# EAGLE design Controller (EAGLE 7.5.0)
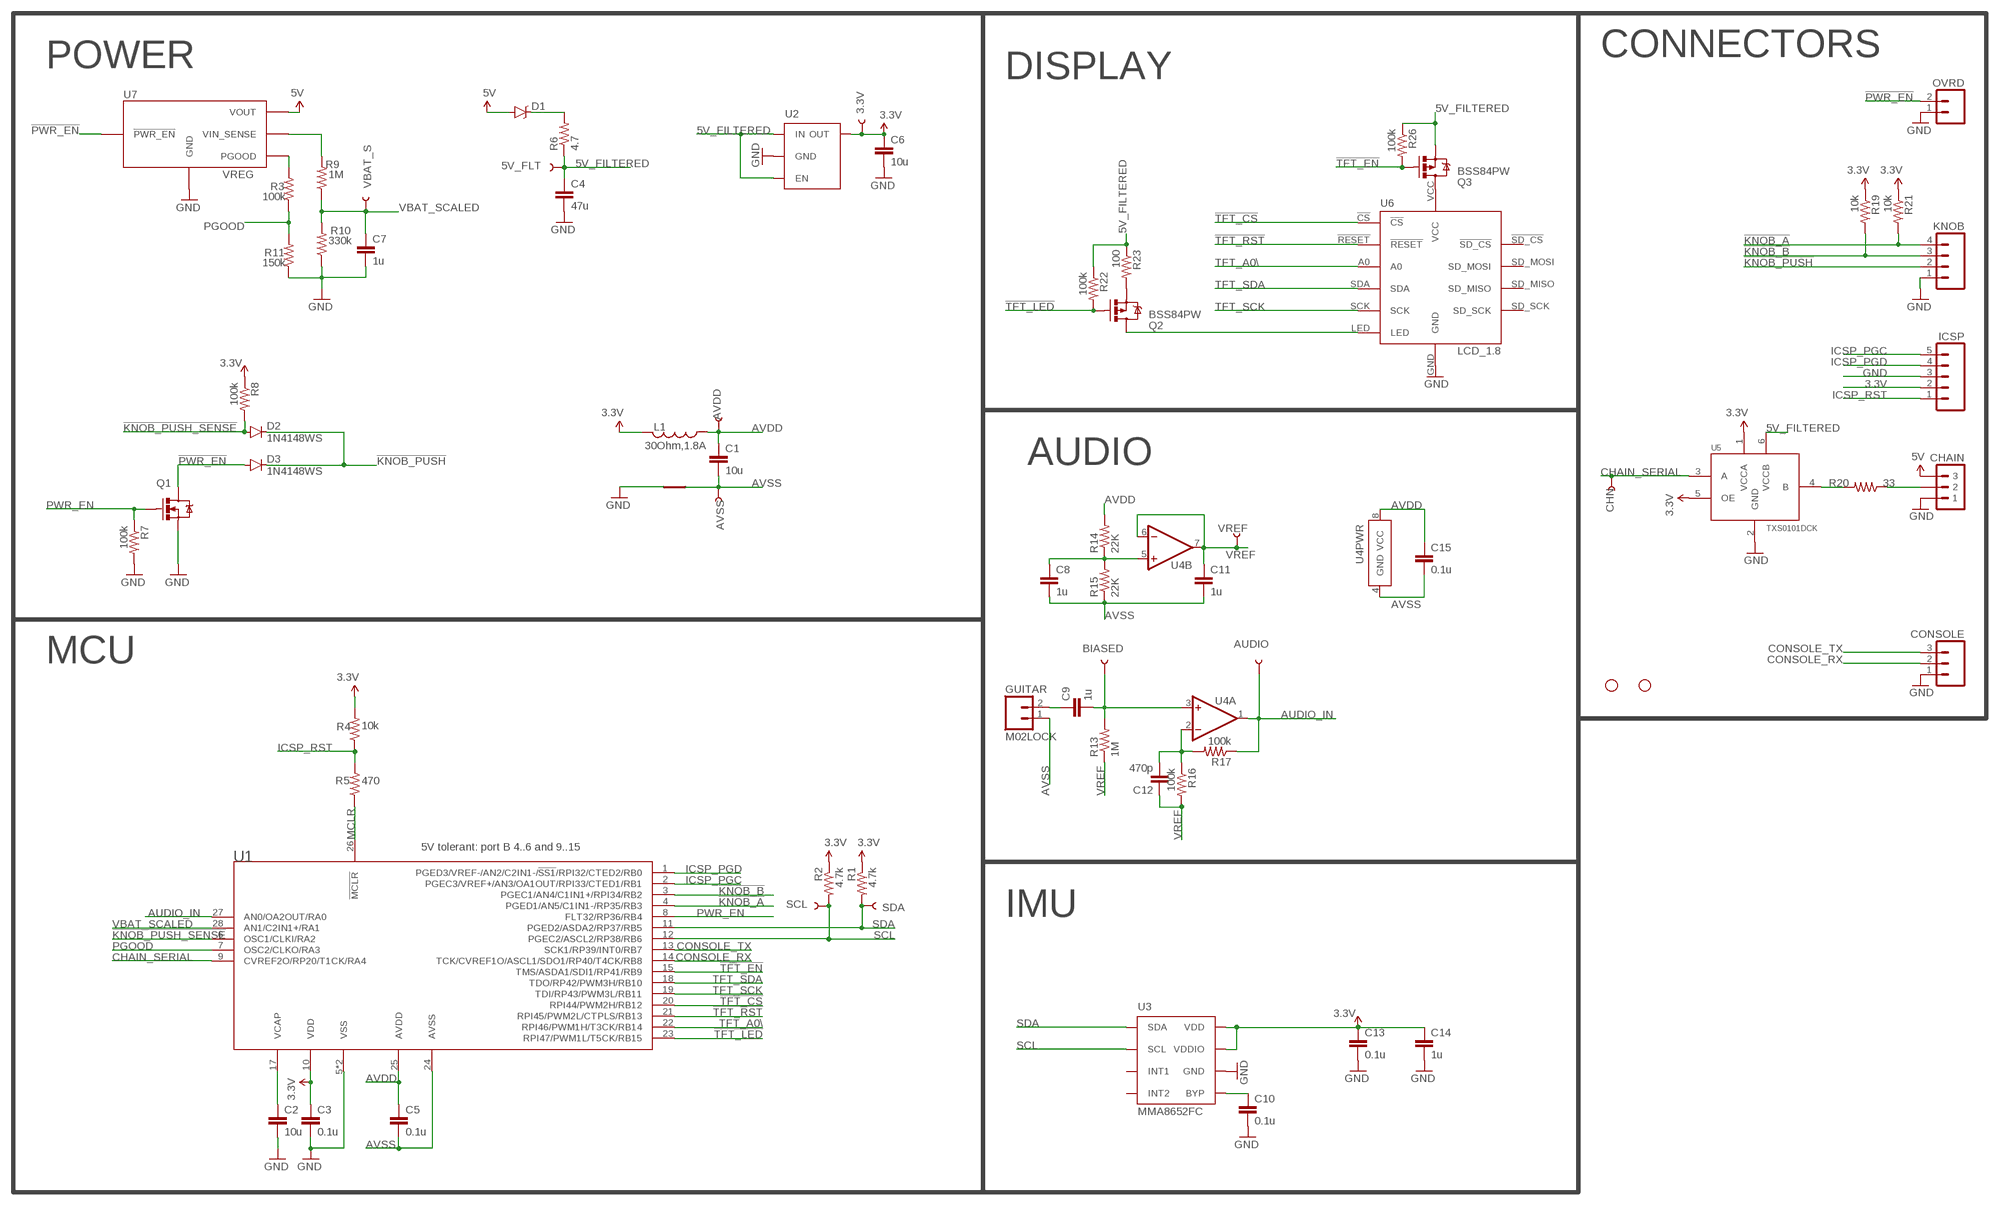
[diagram p0: schematic, sheet 1]

## Parts
3.3V  TEST-POINT3  [PAD.03X.03]
5V_FLT  TEST-POINT3  [PAD.03X.03]
AUDIO  TEST-POINT3  [PAD.03X.03]
AVDD  TEST-POINT3  [PAD.03X.03]
AVSS  TEST-POINT3  [PAD.03X.03]
BIASED  TEST-POINT3  [PAD.03X.03]
C1  10u  CAP0805  [0805]
C2  10u  CAP0805  [0805]
C3  0.1u  CAP0603-CAP  [0603-CAP]
C4  47u  CAP1206  [1206]
C5  0.1u  CAP0603-CAP  [0603-CAP]
C6  10u  10UF-6.3V-20%(0603)  [0603-CAP]
C7  1u  CAP0603-CAP  [0603-CAP]
C8  1u  CAP0603-CAP  [0603-CAP]
C9  1u  CAP0603-CAP  [0603-CAP]
C10  0.1u  CAP0603-CAP  [0603-CAP]
C11  1u  CAP0603-CAP  [0603-CAP]
C12  470p  CAP0603-CAP  [0603-CAP]
C13  0.1u  CAP0603-CAP  [0603-CAP]
C14  1u  CAP0603-CAP  [0603-CAP]
C15  0.1u  CAP0603-CAP  [0603-CAP]
CHAIN  M030.1PWR+SIG  [1X03-0.1PWR+SIG]
CHN  TEST-POINT3  [PAD.03X.03]
CONSOLE  M03LOCK  [1X03_LOCK]
D1  DB2J20900L  DIODE-SCHOTTKY-PMEG4005EJ  [SOD-323]
D2  1N4148WS  [SOD-323]
D3  1N4148WS  [SOD-323]
GUITAR  M02LOCK  [1X02_LOCK]
ICSP  M05LOCK  [1X05_LOCK]
JP1  STAND-OFF  [STAND-OFF]
JP2  STAND-OFF  [STAND-OFF]
KNOB  M04LOCK  [1X04_LOCK]
L1  30Ohm,1.8A  INDUCTOR0603  [0603]
OVRD  M02LOCK  [1X02_LOCK]
Q1  MOSFET-NCHANNEL2N7002PW  [SOT323]
Q2  BSS84PW  [SOT323]
Q3  BSS84PW  [SOT323]
R1  4.7k  RESISTOR0603  [0603-RES]
R2  4.7k  RESISTOR0603  [0603-RES]
R3  100k  RESISTOR0603  [0603-RES]
R4  10k  RESISTOR0603  [0603-RES]
R5  470  RESISTOR0603  [0603-RES]
R6  4.7  RESISTOR0603  [0603-RES]
R7  100k  RESISTOR0603  [0603-RES]
R8  100k  RESISTOR0603  [0603-RES]
R9  1M  RESISTOR0603  [0603-RES]
R10  330k  RESISTOR0603  [0603-RES]
R11  150k  RESISTOR0603  [0603-RES]
R13  1M  RESISTOR0603  [0603-RES]
R14  22K  RESISTOR0603  [0603-RES]
R15  22K  RESISTOR0603  [0603-RES]
R16  100k  RESISTOR0603  [0603-RES]
R17  100k  RESISTOR0603  [0603-RES]
R19  10k  RESISTOR0603  [0603-RES]
R20  33  RESISTOR0603  [0603-RES]
R21  10k  RESISTOR0603  [0603-RES]
R22  100k  RESISTOR0603  [0603-RES]
R23  100  RESISTOR0603  [0603-RES]
R26  100k  RESISTOR0603  [0603-RES]
SCL  TEST-POINT3  [PAD.03X.03]
SDA  TEST-POINT3  [PAD.03X.03]
SH1  SHORT  [SHORT_TOP-8]
U1  DSPIC33EPXXXMC202/502/PT  [QFN-S-28]
U2  MIC5365YC5  [SC70]
U3  MMA8652FC  [10-VFDFN]
U4  MCP6002MS  [MSOP-8]
U5  TXS0101DCK  [SC70-6]
U6  LCD_1.8  [LCD_1.8]
U7  VREG  [VREG]
VBAT_S  TEST-POINT3  [PAD.03X.03]
VREF  TEST-POINT3  [PAD.03X.03]

## Nets
3.3V: 3.3V.P$1 C3.1 C6.1 C13.1 C14.1 ICSP.2 L1.2 R1.1 R2.1 R4.2 R8.1 R19.1 R21.1 U1.10(VDD) U2.5(OUT) U3.1(VDD) U3.8(VDDIO) U5.1(VCCA) U5.5(OE)
5V: CHAIN.P$3 D1.A U7.VOUT
5V_FILTERED: 5V_FLT.P$1 C4.1 Q3.2(S) R6.1 R22.1 R23.1 R26.1 U2.1(IN) U2.3(EN) U5.6(VCCB)
!KNOB_A: KNOB.4 R21.2 U1.4(PGED1/AN5/C1IN1-/RP35/RB3)
!KNOB_B: KNOB.3 R19.2 U1.3(PGEC1/AN4/C1IN1+/RPI34/RB2)
!KNOB_PUSH: D2.C D3.C KNOB.2
!KNOB_PUSH_SENSE: D2.A R8.2 U1.6(OSC1/CLKI/RA2)
!PWR_EN: D3.A OVRD.2 Q1.3(D) U7.!EN(!PWR_EN)
!TFT_CS: U1.20(RPI44/PWM2H/RB12) U6.!CS
!TFT_EN: Q3.1(G) R26.2 U1.15(TMS/ASDA1/SDI1/RP41/RB9)
!TFT_LED: Q2.1(G) R22.2 U1.23(RPI47/PWM1L/T5CK/RB15)
!TFT_RST: U1.21(RPI45/PWM2L/CTPLS/RB13) U6.!RESET
AUDIO_IN: AUDIO.P$1 R17.1 U1.27(AN0/OA2OUT/RA0) U4.1(A:OUT)
AVDD: AVDD.P$1 C1.1 C5.1 C15.1 L1.1 R14.2 U1.25(AVDD) U4.8(PWR:VCC)
AVSS: AVSS.P$1 C1.2 C5.2 C8.2 C11.2 C15.2 GUITAR.1 R15.1 SH1.2 U1.24(AVSS) U4.4(PWR:GND)
CHAIN_SERIAL: CHN.P$1 U1.9(CVREF2O/RP20/T1CK/RA4) U5.3(A)
CONSOLE_RX: CONSOLE.2 U1.14(TCK/CVREF1O/ASCL1/SDO1/RP40/T4CK/RB8)
CONSOLE_TX: CONSOLE.3 U1.13(SCK1/RP39/INT0/RB7)
GND: C2.2 C3.2 C4.2 C6.2 C7.2 C10.2 C13.2 C14.2 CHAIN.P$1 CONSOLE.1 ICSP.3 KNOB.1 OVRD.1 Q1.2(S) R7.2 R10.1 R11.1 SH1.1 U1.5(VSS) U1.16(VSS) U2.2(GND) U3.6(GND) U3.7(GND) U3.9(GND) U5.2(GND) U6.GND U7.GND_OUT(GND)
ICSP_PGC: ICSP.5 U1.2(PGEC3/VREF+/AN3/OA1OUT/RPI33/CTED1/RB1)
ICSP_PGD: ICSP.4 U1.1(PGED3/VREF-/AN2/C2IN1-/!SS1!/RPI32/CTED2/RB0)
ICSP_RST: ICSP.1 R4.1 R5.2
MCLR: R5.1 U1.26(!MCLR)
N$1: C8.1 R14.1 R15.2 U4.5(B:+IN)
N$2: D1.C R6.2
N$3: C9.1 GUITAR.2
N$4: C12.2 R16.1 R17.2 U4.2(A:-IN)
N$5: C2.1 U1.17(VCAP)
N$6: R20.2 U5.4(B)
N$7: BIASED.P$1 C9.2 R13.2 U4.3(A:+IN)
N$8: R3.2 U7.PGOOD
N$12: Q2.3(D) U6.LED
N$13: Q3.3(D) U6.VCC
N$15: Q2.2(S) R23.2
N$18: C10.1 U3.4(BYP)
N$34: CHAIN.P$2 R20.1
PGOOD: R3.1 R11.2 U1.7(OSC2/CLKO/RA3)
PWR_EN: Q1.1(G) R7.1 U1.8(FLT32/RP36/RB4)
SCL: R2.2 SCL.P$1 U1.12(PGEC2/ASCL2/RP38/RB6) U3.2(SCL)
SDA: R1.2 SDA.P$1 U1.11(PGED2/ASDA2/RP37/RB5) U3.10(SDA)
TFT_A0\: U1.22(RPI46/PWM1H/T3CK/RB14) U6.A0
TFT_SCK: U1.19(TDI/RP43/PWM3L/RB11) U6.SCK
TFT_SDA: U1.18(TDO/RP42/PWM3H/RB10) U6.SDA
VBAT_SCALED: C7.1 R9.1 R10.2 U1.28(AN1/C2IN1+/RA1) VBAT_S.P$1
VBAT_SENSE: R9.2 U7.VSENSE(VIN_SENSE)
VREF: C11.1 C12.1 R13.1 R16.2 U4.6(B:-IN) U4.7(B:OUT) VREF.P$1
Unconnected: U3.3(INT1) U3.5(INT2) U6.!SD_CS U6.SD_MISO U6.SD_MOSI U6.SD_SCK

## Notes on the sheet
- POWER | CONNECTORS
- DISPLAY
- AUDIO
- MCU
- 5V tolerant: port B 4..6 and 9..15
- IMU

## Library data of the parts
3.3V 5V_FLT AUDIO AVDD AVSS BIASED CHN SCL SDA VBAT_S VREF = SparkFun-Passives:TEST-POINT: Bare copper test points for troubleshooting or ICT
C1-C5 C7-C15 = SparkFun-Capacitors:CAP: Capacitor Standard 0603 ceramic capacitor, and 0.1" leaded capacitor.
C6 = SparkFun-Capacitors:10UF-6.3V-20%(0603): CAP-11015; PROD_ID: CAP-11015; VALUE: 10uF
CHAIN = Parts:M03: Header 3 Standard 3-pin 0.1" header. Use with straight break away headers (SKU : PRT-00116), right angle break away headers (PRT-00553), swiss pins (PRT-00743), machine pins (PRT-00117), and female headers (PRT-00115). Molex polarized connector foot print use with SKU : PRT-08232 with associated crimp pins and housings.
CONSOLE = SparkFun-Connectors:M03: Header 3 Standard 3-pin 0.1" header. Use with straight break away headers (SKU : PRT-00116), right angle break away headers (PRT-00553), swiss pins (PRT-00743), machine pins (PRT-00117), and female headers (PRT-00115). Molex polarized connector foot print use with SKU : PRT-08232 with associated crimp pins and housings.
D1 = SparkFun-DiscreteSemi:DIODE-SCHOTTKY: Schottky diodes in SFE's production catalog BAT20J 1A 23V 0.62Vf RB751 120mA 40V 0.37Vf PMEG4005EJ 0.5A 40V 0.42Vf MBRA140 1A 40V 0.5Vf B340A 3A 40V SMA; PROD_ID: DIO-10955; VALUE: PMEG4005EJ
D2 D3 = Parts:1N4148WS
GUITAR OVRD = SparkFun-Connectors:M02: Standard 2-pin 0.1" header. Use with - straight break away headers ( PRT-00116) - right angle break away headers (PRT-00553) - swiss pins (PRT-00743) - machine pins (PRT-00117) - female headers (PRT-00115) Molex polarized connector foot print use with: PRT-08233 with associated crimp pins and housings. 2.54_SCREWTERM for use with PRT-10571. 3.5mm Screw Terminal footprints for PRT-08084 5mm Screw Terminal footprints for use with PRT-08433
ICSP = SparkFun-Connectors:M05: Header 5 Standard 5-pin 0.1" header. Use with straight break away headers (SKU : PRT-00116), right angle break away headers (PRT-00553), swiss pins (PRT-00743), machine pins (PRT-00117), and female headers (PRT-00115). Molex polarized connector foot print use with SKU : PRT-08230 with associated crimp pins and housings.
JP1 JP2 = SparkFun:STAND-OFF: Stand Off This is the mechanical footprint for a #4 phillips button head screw. Use the keepout ring to avoid running the screw head into surrounding components. SKU : PRT-00447
KNOB = SparkFun-Connectors:M04: Header 4 Standard 4-pin 0.1" header. Use with straight break away headers (SKU : PRT-00116), right angle break away headers (PRT-00553), swiss pins (PRT-00743), machine pins (PRT-00117), and female headers (PRT-00115). Molex polarized connector foot print use with SKU : PRT-08231 with associated crimp pins and housings. 1MM SMD Version SKU: PRT-10208
L1 = SparkFun-Passives:INDUCTOR: Inductors Basic Inductor/Choke - 0603 and 1206. Footprints are not proven and vary greatly between part numbers. SRN6045- 33uH, 20% 1.4A SDR0403-560KL - 56uH, 10%, 500mA RMS/740mA peak
Q1 = SparkFun-DiscreteSemi:MOSFET-NCHANNEL: Common NMOSFET Parts MFG P/N Store ID Prod ID FDD8780 TRANS-09984 SI7820DN TRANS-11055 FDS6630A IC-08089 2N7002PW TRANS-11151 FQP30N06L COM-10213 TRANS-10060 BSS123LT1G TRANS-08345 BSS138 TRANS-00830 BS170 2N7000; PROD_ID: TRANS-11151
Q2 Q3 = Parts:BSS84PW: P-Channel FET
R1-R11 R13-R17 R19-R23 R26 = SparkFun-Resistors:RESISTOR: Resistor Basic schematic elements and footprints for 0603, 1206, and PTH resistors.
SH1 = Parts:SHORT: Short between two nets
U1 = Parts:DSPIC33EPXXXMC202/502
U2 = Parts:MIC5365: MIC5365/6 High-Performance Single 150mA LDO The MIC5365/6 is an advanced general purpose linear regulator offering high power supply rejection (PSRR) in an ultra-small 1mm × 1mm package. The MIC5366 includes an auto-discharge feature that is activated when the enable pin is low. The MIC5365/6 is capable of sourcing 150mA output current and offers high PSRR making it an ideal solution for any portable electronic application. Ideal for battery-powered applications, the MIC5365/6 offers 2% initial accuracy, low dropout voltage (155mV @ 150mA), and low ground current (typically 29μA). The MIC5365/6 can also be put into a zero-off-mode current state, drawing virtually no current when disabled. The MIC5365/6 is available in several advanced packages including a lead-free (RoHS-compliant) 1mm × 1mm Thin MLF® occupying only 1mm2 of PCB area, a 75% reduction in board area compared to SC-70 and 2mm × 2mm MLF packages. It is also available in a thin SOT23-5 package. The MIC5365/6 has an operating junction temperature range of –40°C to 125°C. Data sheets and support documentation can be found on Micrel’s web site at: www.micrel.com.
U3 = Parts:MMA8652FC: Xtrinsic MMA8652FC 3-Axis, 12-bit Digital Accelerometer http://cache.freescale.com/files/sensors/doc/data_sheet/MMA8652FC.pdf
U4 = Parts:MCP6002
U5 = Parts:TXS0101
U6 = Parts:LCD_1.8
U7 = Parts:VREG

## Board
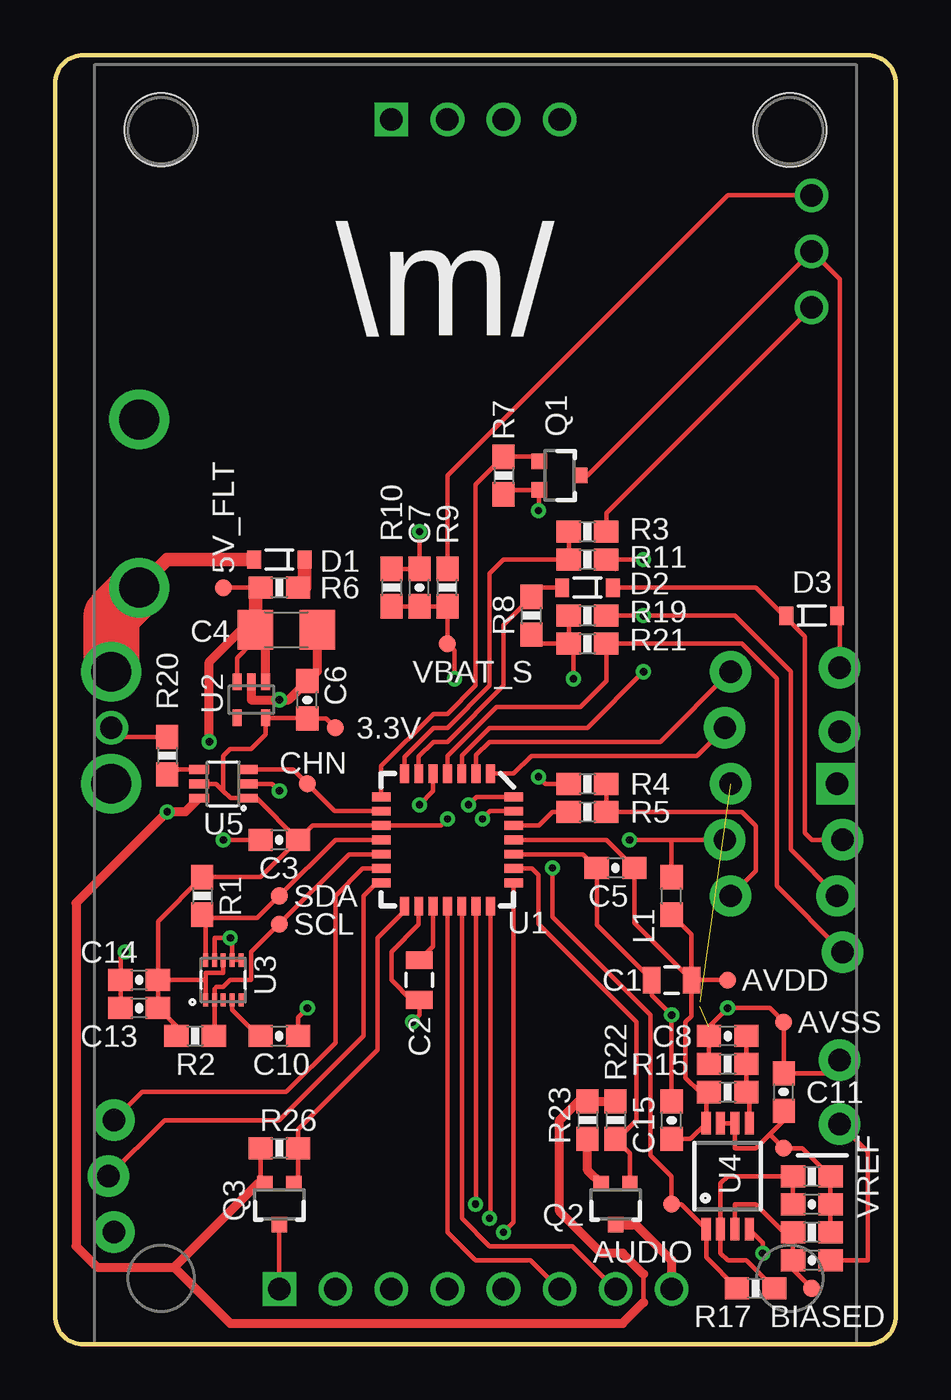
[diagram p1: board, top side]
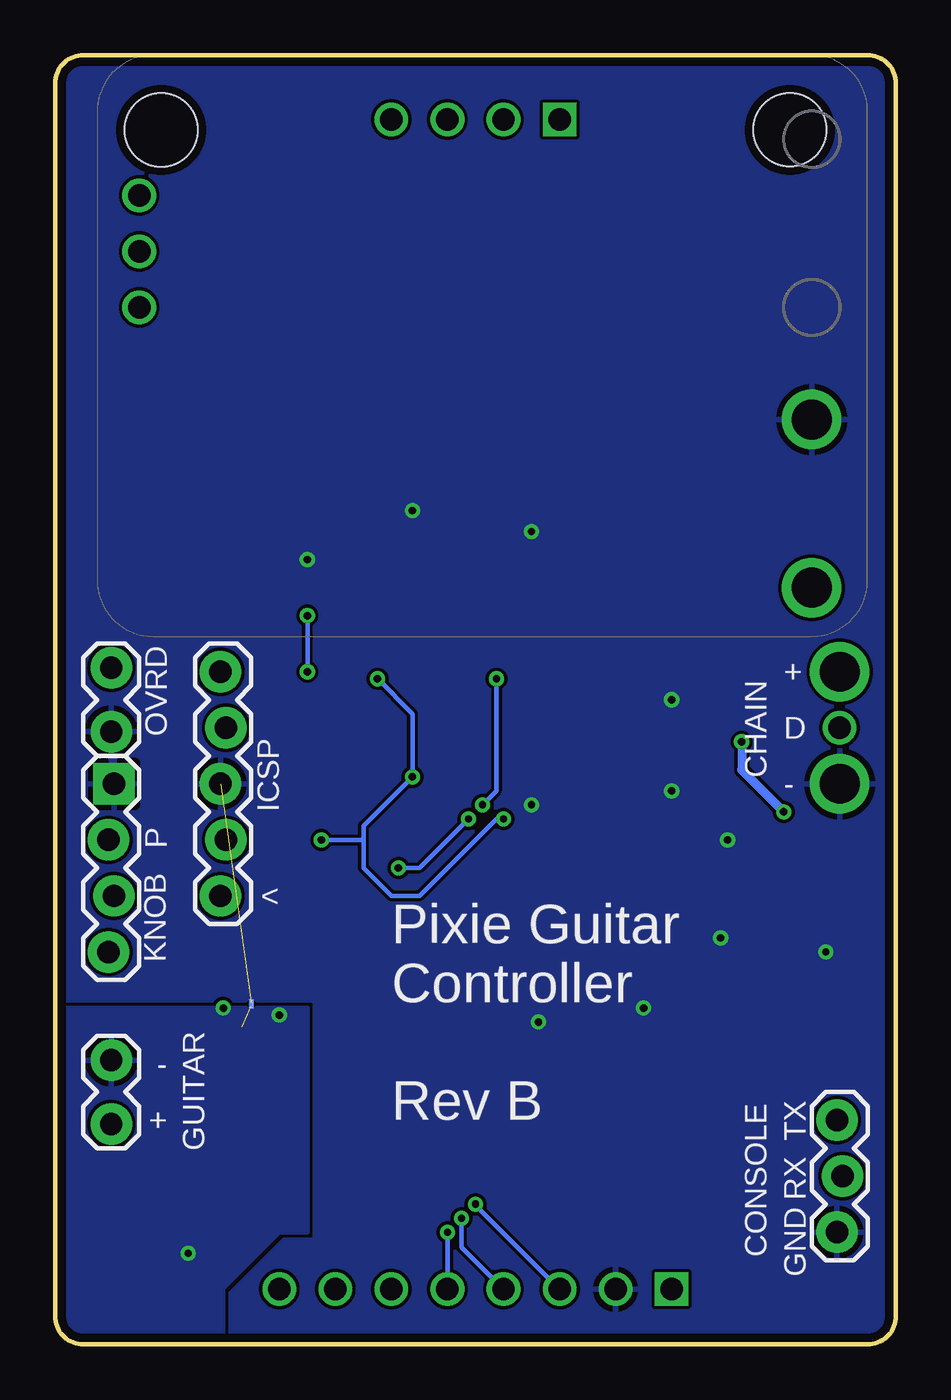
[diagram p2: board, bottom side, seen from below]

Size 38.1 x 58.42 mm. Coordinates in mm from the lower left corner, seen from the top.
Outline: 0,1.27 0,57.15 arc-90 1.27,58.42 36.83,58.42 arc-90 38.1,57.15 38.1,1.27 arc-90 36.83,0 1.27,0 arc-90 0,1.27
Copper layers (1*16): Top 0.0356mm / dielectric 1.5011mm / Bottom 0.0356mm
Design rules "oshpark-2layer *": minimum track width 6mil, minimum drill 13mil, track to track 6mil, track to pad 6mil, pad to pad 6mil, via to via 6mil, smd to smd 6mil, copper to edge 15mil, drill to drill 6mil, minimum pad ring 7mil, minimum via ring 7mil, stop-mask expansion 2.5mil, vias tented up to drill 15mil, thermal gap 10mil

### Footprints (pad centres in the part's own frame; a part is rotated, then mirrored left to right if it is on the bottom)
PAD.03X.03 = smd 0.762 x 0.762: P$1 0,0
0805 = smd 0.8 x 1.2: 1 -0.9,0; 2 0.9,0
0603-CAP = smd 1.1 x 1: 1 -0.85,0; 2 0.85,0
1206 = smd 1.6 x 1.8: 1 -1.4,0; 2 1.4,0
1X03-0.1PWR+SIG = drill 1.8: P$1 -2.54,0; P$3 2.54,0 | drill 1.016: P$2 0,0
1X03_LOCK = drill 1.016 pad 1.88: 1 0,0.127; 2 2.54,-0.127; 3 5.08,0.127
SOD-323 = smd 0.63 x 0.83: A 1.15,0; C -1.15,0
1X02_LOCK = drill 1.016 pad 1.88: 1 -0.178,0; 2 2.718,0
1X05_LOCK = drill 1.016 pad 1.88: 1 0,0.127; 2 2.54,-0.127; 3 5.08,0.127; 4 7.62,-0.127; 5 10.16,0.127
STAND-OFF = hole 3.302: 0,0
1X04_LOCK = drill 1.016 pad 1.88 square: 1 0,0.127 | drill 1.016 pad 1.88: 2 2.54,-0.127; 3 5.08,0.127; 4 7.62,-0.127
0603 = smd 1.1 x 1: 1 -0.85,0; 2 0.85,0
SOT323 = smd 0.7 x 0.7: 1 -0.65,-0.925; 2 0.65,-0.925; 3 0,0.925
0603-RES = smd 1.1 x 1: 1 -0.85,0; 2 0.85,0
SHORT_TOP-8 = smd 0.203 x 0.203: 1 0.102,0; 2 -0.102,0
QFN-S-28 = smd 0.85 x 0.4: 1 -3,1.95; 2 -3,1.3; 3 -3,0.65; 4 -3,0; 5 -3,-0.65; 6 -3,-1.3; 7 -3,-1.95; 15 3,-1.95; 16 3,-1.3; 17 3,-0.65; 18 3,0; 19 3,0.65; 20 3,1.3; 21 3,1.95 | smd 0.4 x 0.85: 8 -1.95,-3; 9 -1.3,-3; 10 -0.65,-3; 11 0,-3; 12 0.65,-3; 13 1.3,-3; 14 1.95,-3; 22 1.95,3; 23 1.3,3; 24 0.65,3; 25 0,3; 26 -0.65,3; 27 -1.3,3; 28 -1.95,3
SC70 = smd 0.4 x 0.75: 1 -0.65,-0.825; 2 0,-0.825; 3 0.65,-0.825; 4 0.65,0.825; 5 -0.65,0.825
10-VFDFN = smd 0.6 x 0.225: 1 -0.9,0.8; 2 -0.9,0.4; 3 -0.9,0; 4 -0.9,-0.4; 5 -0.9,-0.8; 6 0.9,-0.8; 7 0.9,-0.4; 8 0.9,0; 9 0.9,0.4; 10 0.9,0.8
MSOP-8 = smd 0.41 x 1.02: 1 -0.975,-2.4; 2 -0.325,-2.4; 3 0.325,-2.4; 4 0.975,-2.4; 5 0.975,2.4; 6 0.325,2.4; 7 -0.325,2.4; 8 -0.975,2.4
SC70-6 = smd 0.4 x 0.9: 1 -0.65,-1.1; 2 0,-1.1; 3 0.65,-1.1; 4 0.65,1.1; 5 0,1.1; 6 -0.65,1.1
LCD_1.8 = drill 1.016: !CS -3.81,2.5; !RESET -1.27,2.5; A0 1.27,2.5; GND -6.35,2.5; LED 8.89,2.5; SCK 6.35,2.5; SD_MISO 1.27,55.5; SD_MOSI -1.27,55.5; SD_SCK 3.81,55.5; SDA 3.81,2.5 | drill 1.016 square: !SD_CS -3.81,55.5; VCC -8.89,2.5
VREG = drill 1.016: !EN 10.16,2.54; PGOOD 12.7,2.54; VSENSE 7.62,2.54 | drill 1.8: GND_OUT 17.78,33.02; VOUT 25.4,33.02

### Placement (x,y rotation side)
3.3V  12.7,27.94 270 top
5V_FLT  7.62,34.29 90 top
AUDIO  27.94,6.35 0 top
AVDD  30.48,16.51 0 top
AVSS  33.02,14.61 0 top
BIASED  34.29,2.54 0 top
C1  27.94,16.51 180 top
C2  16.51,16.51 270 top
C3  10.16,22.86 180 top
C4  10.48,32.38 0 top
C5  25.4,21.59 180 top
C6  11.43,29.21 90 top
C7  16.51,34.29 90 top
C8  30.48,13.97 180 top
C9  34.29,3.81 180 top
C10  10.16,13.97 0 top
C11  33.02,11.43 90 top
C12  34.29,6.35 180 top
C13  3.81,15.24 180 top
C14  3.81,16.51 180 top
C15  27.94,10.16 90 top
CHAIN  2.54,27.94 90 bottom
CHN  11.43,25.4 270 top
CONSOLE  2.54,5.08 90 bottom
D1  10.16,35.56 180 top
D2  24.13,34.29 180 top
D3  34.29,33.02 0 top
GUITAR  35.56,12.7 270 bottom
ICSP  30.48,20.32 90 bottom
JP1  33.3,55.03 0 top
JP2  4.81,55.03 0 top
KNOB  35.56,25.4 270 bottom
L1  27.94,20.32 90 top
OVRD  35.56,27.94 90 bottom
Q1  22.86,39.37 270 top
Q2  25.4,6.35 180 top
Q3  10.16,6.35 180 top
R1  6.67,20.32 270 top
R2  6.35,13.97 0 top
R3  24.13,36.83 0 top
R4  24.13,25.4 180 top
R5  24.13,24.13 0 top
R6  10.16,34.29 0 top
R7  20.32,39.37 270 top
R8  21.59,33.02 90 top
R9  17.78,34.29 90 top
R10  15.24,34.29 270 top
R11  24.13,35.56 180 top
R13  34.29,5.08 180 top
R14  30.48,11.43 180 top
R15  30.48,12.7 0 top
R16  34.29,7.62 0 top
R17  31.75,2.54 0 top
R19  24.13,33.02 0 top
R20  5.08,26.67 270 top
R21  24.13,31.75 0 top
R22  25.4,10.16 270 top
R23  24.13,10.16 270 top
R26  10.16,8.89 0 top
SCL  10.16,19.05 0 top
SDA  10.16,20.32 0 top
SH1  29.21,15.42 90 bottom
U1  17.78,22.86 270 top
U2  8.89,29.21 180 top
U3  7.62,16.51 90 top
U4  30.48,7.62 0 top
U5  7.62,25.4 90 top
U6  19.05,0 0 top
U7  36.83,59.69 270 bottom
VBAT_S  17.78,31.75 270 top
VREF  33.02,8.89 0 top

### Tracks (layer width: path | path; a pad name or v marks a point on that pad's centre or on a via)
3.3V  (via drill 0.33)
  Top 0.203: U3.1 6.82,16.51 | 6.82,16.51 6.82,16.83 7.62,16.83 U3.8 | C14.1 6.82,16.51 | C14.1 C13.1 5.5,14.4 R2.1 | R21.1 R19.1 22.86,33.44 | C3.1 11.66,23.51 U1.10 17.48,23.51 v17.78,23.81 | C3.1 9.12,24.75 U5.1 7.95,24.75 7.62,25.08 | 7.62,25.08 7.3,25.4 U5.5 | R4.2 22.23,25.4 v21.91,25.72 | R21.1 23.5,31.54 v23.5,30.16 | C3.1 9.32,21.17 R1.1 4.66,19.16 C14.1 | 7.62,25.08 7.62,26.67 7.94,26.99 8.89,26.99 9.54,27.64 U2.5 11.4,28.39 C6.1 12.28,28.36 3.3V.P$1 | ICSP.2 27.94,22.86 | 27.94,22.86 v26.04,22.86 | L1.2 27.94,22.86 | R8.1 22.01,31.75 R21.1
  Bottom 0.203: v17.78,23.81 18.1,23.81 21.59,20.32 22.86,20.32 24.13,21.59 24.13,22.86 | 24.13,22.86 24.13,23.5 v21.91,25.72 21.91,28.57 v23.5,30.16 | v26.04,22.86 24.13,22.86
5V
  Top 0.61: U7.VOUT 5.08,35.56 D1.A
  Top 2.54: U7.VOUT 2.54,33.02 CHAIN.P$3
5V_FILTERED  (via drill 0.33)
  Top 0.203: Q3.2 9.31,7.47 R26.1 | 5V_FLT.P$1 R6.1 | 26.67,1.91 26.67,3.17 | 23.71,11.01 R23.1 | U2.3 8.24,31.1 8.89,31.75 8.89,32.2 C4.1
  Top 0.406: U5.6 5.9,24.13 v5.08,24.13 0.95,20 0.95,4.45 1.91,3.49 5.4,3.49 | 5.4,3.49 7.94,0.95 25.72,0.95 26.67,1.91 | 26.67,3.17 25.72,4.13 24.77,4.13 22.86,6.03 22.86,10.16 23.71,11.01 | R23.1 R22.1 | 5.4,3.49 9.18,7.28 Q3.2 | U2.1 9.54,32.56 9.08,33.02 6.99,30.93 v6.99,27.3
  Top 0.61: R6.1 arc90 9.08,34.06 9.08,33.02 C4.1
  Bottom 0.406: v6.99,27.3 6.99,26.04 v5.08,24.13
!KNOB_A
  Top 0.203: KNOB.4 32.7,20.77 32.7,30.16 31.11,31.75 R21.2 24.98,30.06 23.81,28.89 20,28.89 17.78,26.67 U1.4
!KNOB_B  (via drill 0.33)
  Top 0.203: KNOB.3 33.34,22.42 33.34,30.48 30.8,33.02 v26.67,33.02 R19.2 | U1.3 18.43,26.68 19.68,27.94 24.13,27.94 v26.67,30.48
  Bottom 0.203: v26.67,30.48 v26.67,33.02
!KNOB_PUSH
  Top 0.203: KNOB.2 34.29,22.86 33.97,23.18 33.97,32.07 33.02,33.02 | 33.11,33.12 33.14,33.09 D3.C 33.02,33.02 | 33.02,33.02 31.75,34.29 D2.C
!KNOB_PUSH_SENSE
  Top 0.203: U1.6 16.48,26.64 17.14,27.3 17.78,27.3 20.32,29.84 20.32,32.6 R8.2 22.01,34.29 D2.A
!PWR_EN
  Top 0.203: OVRD.2 35.56,33.02 | 35.56,33.02 35.56,48.26 U7.!EN 24.13,39.37 Q1.3 | D3.A 35.56,33.02
!TFT_CS  (via drill 0.33)
  Top 0.203: U1.20 19.08,6.38 v19.05,6.35
  Bottom 0.203: v19.05,6.35 19.05,6.31 U6.!CS
!TFT_EN
  Top 0.203: Q3.1 11.01,7.47 R26.2 11.01,9.74 14.61,13.34 14.61,18.41 15.83,19.64 U1.15
!TFT_LED
  Top 0.203: U1.23 21.62,21.56 21.91,21.27 21.91,19.05 26.35,14.61 26.35,10.16 25.5,9.31 R22.2 26.05,8.66 Q2.1
!TFT_RST  (via drill 0.33)
  Top 0.203: v19.68,5.71 19.73,5.76 U1.21
  Bottom 0.203: U6.!RESET 19.68,4.41 v19.68,5.71
AUDIO_IN  (via drill 0.33)
  Top 0.203: R17.1 29.5,3.94 U4.1 28.38,6.35 AUDIO.P$1 27.94,7.62 26.99,8.57 26.99,14.92 22.54,19.37 v22.54,21.59 | U1.27 19.71,24.16 v19.37,23.81
  Bottom 0.203: v22.54,21.59 21.59,21.59 v19.37,23.81
AVDD
  Top 0.203: C15.1 28.8,9.31 U4.8 29.5,11.43 R14.2 29.21,11.43 28.57,12.06 28.57,14.61 28.84,14.87 C1.1 | U1.25 24.98,22.86 C5.1 26.25,19.1 C1.1 | AVDD.P$1 C1.1 | L1.1 28.84,18.57 C1.1
AVSS  (via drill 0.33)  (1 unrouted)
  Top 0.203: R15.1 C8.2 29.63,14.39 v30.48,15.24 32.38,15.24 AVSS.P$1 C11.2 34.96,12.28 GUITAR.1 | U1.24 23.93,22.21 C5.2 | C5.2 24.5,21.54 | C5.2 24.55,19 C1.2 27.04,15.82 v27.94,14.92 C15.2 | U4.4 32.07,4.61 v32.07,4.13
  pour Bottom (rank 2): 38.1,15.24 26.67,15.24 26.67,5.08 27.94,5.08 30.48,2.54 30.48,0 38.1,0
CHAIN_SERIAL
  Top 0.203: U1.9 12.67,24.16 CHN.P$1 10.78,26.05 U5.3
CONSOLE_RX
  Top 0.203: CONSOLE.2 4.95,10.16 10.16,10.16 13.97,13.97 13.97,20.32 14.56,20.91 U1.14
CONSOLE_TX
  Top 0.203: CONSOLE.3 3.94,11.43 10.48,11.43 12.7,13.65 12.7,20.32 13.94,21.56 U1.13
GND  (via drill 0.33)  (1 unrouted)
  Top 0.203: U1.5 17.13,25.07 v16.51,24.45 | v16.19,14.61 16.51,14.92 C2.2 16.14,15.61 15.24,16.51 15.24,17.78 16.48,19.02 U1.16 | C10.2 11.01,14.82 v11.43,15.24 | U3.6 U3.7 8.02,18.41 v7.94,18.41 7.22,18.41 U3.9 | C3.2 v7.62,22.86 | U5.2 9.84,25.4 v10.16,25.08 | R10.1 C7.2 v16.51,36.83 | R7.2 20.52,38.72 Q1.2 21.93,37.81 v21.91,37.78 | C13.2 C14.2 2.96,17.57 v3.17,17.78 | 25.4,35.14 R11.1 v26.67,35.56
  Top 0.406: C4.2 11.88,30.51 C6.2 10.58,29.21 v10.16,29.21 8.89,29.21 U2.2
  pour Bottom (rank 6): 0,58.42 38.1,58.42 38.1,0 0,0
ICSP_PGC
  Top 0.203: ICSP.5 27.43,27.3 19.68,27.3 19.08,26.7 U1.2
ICSP_PGD
  Top 0.203: ICSP.4 29.08,26.67 21.59,26.67 20.78,25.86 U1.1
ICSP_RST
  Top 0.203: ICSP.1 31.75,21.46 31.75,23.5 31.11,24.13 R5.2 R4.1
MCLR
  Top 0.203: R5.1 22.54,24.13 21.92,23.51 U1.26
N$1
  Top 0.203: U4.5 31.45,11.3 R14.1 R15.2 C8.1
N$2
  Top 0.61: D1.C 11.31,34.29 R6.2
N$3
  Top 0.203: C9.1 36.83,3.81 36.83,8.71 GUITAR.2
N$4
  Top 0.203: R17.2 31.33,3.81 30.48,3.81 30.16,4.13 U4.2 30.16,7.29 30.48,7.62 R16.1 C12.2
N$5
  Top 0.203: C2.1 17.13,18.03 U1.17
N$6
  Top 0.203: U5.4 5.31,26.05 arc90 R20.2
N$7
  Top 0.203: U4.3 30.8,6.35 31.75,6.35 33.02,5.08 R13.2 C9.2 33.44,3.39 BIASED.P$1
N$8
  Top 0.203: U7.PGOOD 24.98,37.68 R3.2
N$12
  Top 0.406: Q2.3 26.32,5.42 27.94,3.81 U6.LED
N$13
  Top 0.203: U6.VCC Q3.3
N$15
  Top 0.406: Q2.2 24.13,7.89 R23.2
N$18
  Top 0.203: U3.4 8.02,15.16 9.21,13.97 C10.1
N$34
  Top 0.203: R20.1 2.96,27.52 CHAIN.P$2
PGOOD
  Top 0.203: U1.7 15.83,26.62 17.14,27.94 17.78,27.94 19.68,29.84 19.68,34.92 20.32,35.56 R11.2 R3.1
PWR_EN
  Top 0.203: Q1.1 21.73,40.22 R7.1 19.05,38.95 19.05,29.84 17.78,28.57 17.14,28.57 14.78,26.21 U1.8
SCL
  Top 0.203: R2.2 7.22,13.99 U3.2 7.22,16.11 7.3,16.19 7.62,16.19 7.94,16.51 8.89,16.51 8.89,17.78 SCL.P$1 13.32,22.21 U1.12
SDA
  Top 0.203: U1.11 12.7,22.86 SDA.P$1 9.16,19.32 6.82,19.32 | U3.10 6.82,19.32 | 6.82,19.32 R1.2
TFT_A0\  (via drill 0.33)
  Top 0.203: v20.32,5.08 20.78,5.54 U1.22
  Bottom 0.203: v20.32,5.08 U6.A0
TFT_SCK
  Top 0.203: U1.19 18.43,5.7 19.68,4.45 23.45,4.45 U6.SCK
TFT_SDA
  Top 0.203: U1.18 17.78,5.08 19.05,3.81 21.55,3.81 U6.SDA
VBAT_SCALED  (via drill 0.33)
  Top 0.203: U1.28 19.09,24.81 v18.73,24.45 | R10.2 C7.1 R9.1 VBAT_S.P$1 18.1,31.43 v18.1,30.16
  Bottom 0.203: v18.1,30.16 18.1,25.08 v18.73,24.45
VBAT_SENSE
  Top 0.203: U7.VSENSE 30.48,52.07 17.78,39.37 R9.2
VREF
  Top 0.203: U4.7 U4.6 30.8,8.89 31.75,8.89 32.38,9.53 | 32.38,9.53 33.02,10.16 C11.1 | 32.38,9.53 VREF.P$1 33.87,8.89 R16.2 R13.1 C12.1

### Text on the board
tNames: \\m/
bNames: + | D | - | P | < | - | TX | + | Pixie Guitar / Controller / / Rev B | RX | GND